# EAGLE design aiotsixsense (EAGLE 7.7.0)
CNAME: AIoT SixSense; CREVISION: R1; DESIGNER: lamloei.com/aiot_sixsense
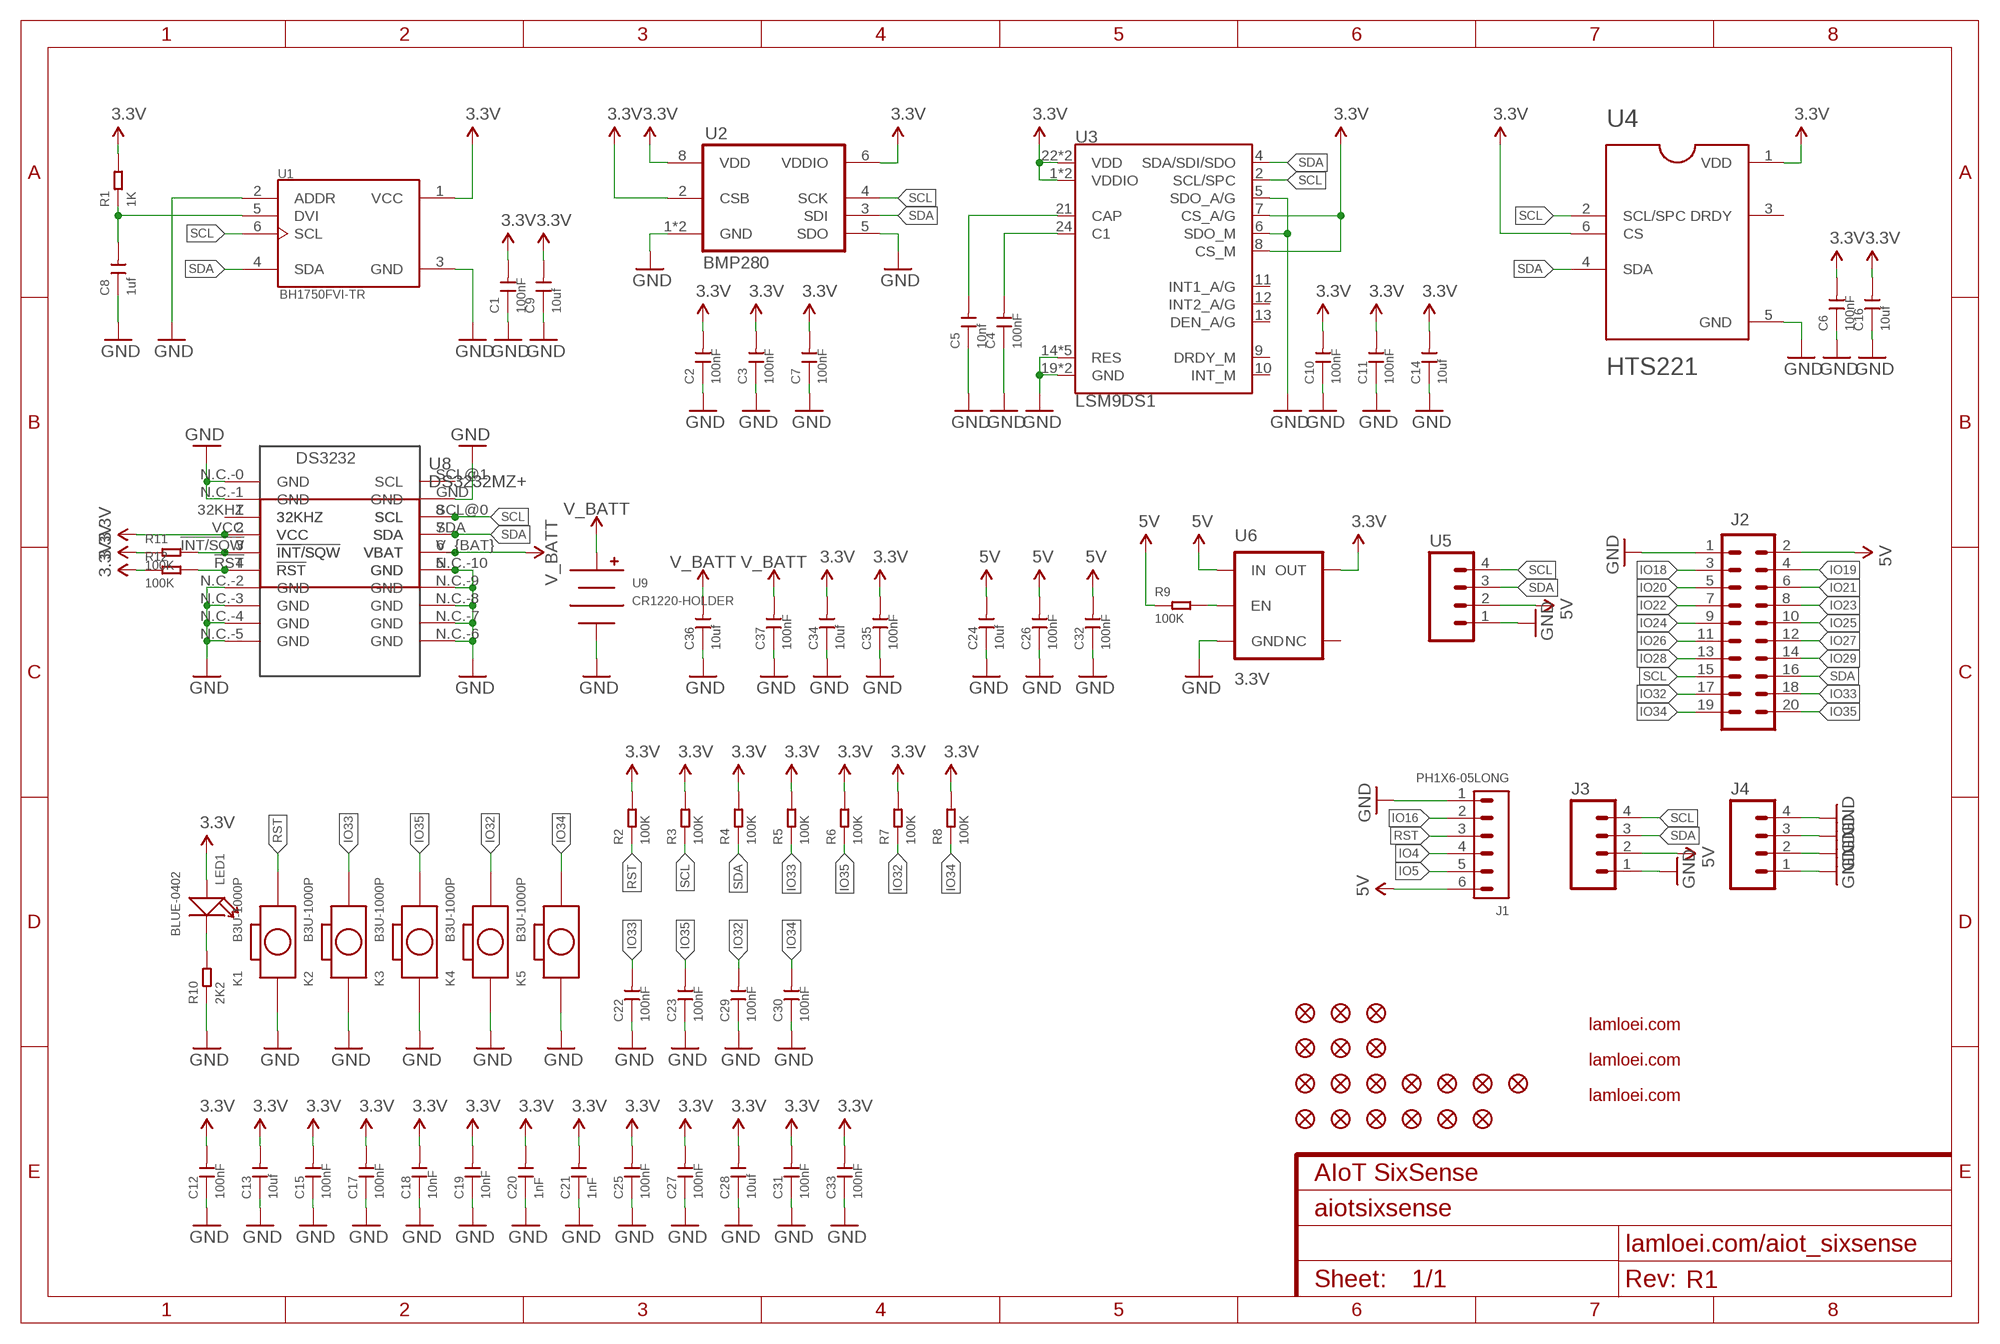
[diagram p0: schematic, sheet 1]

## Parts
C1  100nF  CERAMIC-47PF-50V-5%-NP0(0402)  [C0402]
C2  100nF  CERAMIC-47PF-50V-5%-NP0(0402)  [C0402]
C3  100nF  CERAMIC-47PF-50V-5%-NP0(0402)  [C0402]
C4  100nF  CERAMIC-47PF-50V-5%-NP0(0402)  [C0402]
C5  10nf  CERAMIC-10NF-50V-10%-X7R(0402)  [C0402]
C6  100nF  CERAMIC-47PF-50V-5%-NP0(0402)  [C0402]
C7  100nF  CERAMIC-47PF-50V-5%-NP0(0402)  [C0402]
C8  1uf  CERAMIC-1UF-10V-10%-X5R(0402)  [C0402]
C9  10uf  CERAMIC-22UF-6.3V-20%-X5R(0805)  [C0805]
C10  100nF  CERAMIC-47PF-50V-5%-NP0(0402)  [C0402]
C11  100nF  CERAMIC-47PF-50V-5%-NP0(0402)  [C0402]
C12  100nF  CERAMIC-47PF-50V-5%-NP0(0402)  [C0402]
C13  10uf  CERAMIC-22UF-6.3V-20%-X5R(0805)  [C0805]
C14  10uf  CERAMIC-22UF-6.3V-20%-X5R(0805)  [C0805]
C15  100nF  CERAMIC-47PF-50V-5%-NP0(0402)  [C0402]
C16  10uf  CERAMIC-22UF-6.3V-20%-X5R(0805)  [C0805]
C17  100nF  CERAMIC-47PF-50V-5%-NP0(0402)  [C0402]
C18  10nF  CERAMIC-47PF-50V-5%-NP0(0402)  [C0402]
C19  10nF  CERAMIC-47PF-50V-5%-NP0(0402)  [C0402]
C20  1nF  CERAMIC-47PF-50V-5%-NP0(0402)  [C0402]
C21  1nF  CERAMIC-47PF-50V-5%-NP0(0402)  [C0402]
C22  100nF  CERAMIC-47PF-50V-5%-NP0(0402)  [C0402]
C23  100nF  CERAMIC-47PF-50V-5%-NP0(0402)  [C0402]
C24  10uf  CERAMIC-22UF-6.3V-20%-X5R(0805)  [C0805]
C25  100nF  CERAMIC-47PF-50V-5%-NP0(0402)  [C0402]
C26  100nF  CERAMIC-47PF-50V-5%-NP0(0402)  [C0402]
C27  100nF  CERAMIC-47PF-50V-5%-NP0(0402)  [C0402]
C28  10uf  CERAMIC-22UF-6.3V-20%-X5R(0805)  [C0805]
C29  100nF  CERAMIC-47PF-50V-5%-NP0(0402)  [C0402]
C30  100nF  CERAMIC-47PF-50V-5%-NP0(0402)  [C0402]
C31  100nF  CERAMIC-47PF-50V-5%-NP0(0402)  [C0402]
C32  100nF  CERAMIC-47PF-50V-5%-NP0(0402)  [C0402]
C33  100nF  CERAMIC-47PF-50V-5%-NP0(0402)  [C0402]
C34  10uf  CERAMIC-22UF-6.3V-20%-X5R(0805)  [C0805]
C35  100nF  CERAMIC-47PF-50V-5%-NP0(0402)  [C0402]
C36  10uf  CERAMIC-22UF-6.3V-20%-X5R(0805)  [C0805]
C37  100nF  CERAMIC-47PF-50V-5%-NP0(0402)  [C0402]
J1  PH1X6-05LONG  [PHL005-1-6]
J2  M10X2  [2X10]
J3  M04SMD_RA_FEMALE  [1X04_SMD_RA_FEMALE]
J4  M04SMD_RA_FEMALE  [1X04_SMD_RA_FEMALE]
K1  B3U-1000P  SMD-BUTTON-WITHOUT-BOSS-(2P-3X2.5MM)  [SW2-SMD-3.0X2.5X1.2+0.4MM]
K2  B3U-1000P  SMD-BUTTON-WITHOUT-BOSS-(2P-3X2.5MM)  [SW2-SMD-3.0X2.5X1.2+0.4MM]
K3  B3U-1000P  SMD-BUTTON-WITHOUT-BOSS-(2P-3X2.5MM)  [SW2-SMD-3.0X2.5X1.2+0.4MM]
K4  B3U-1000P  SMD-BUTTON-WITHOUT-BOSS-(2P-3X2.5MM)  [SW2-SMD-3.0X2.5X1.2+0.4MM]
K5  B3U-1000P  SMD-BUTTON-WITHOUT-BOSS-(2P-3X2.5MM)  [SW2-SMD-3.0X2.5X1.2+0.4MM]
LED1  BLUE-0402  SMD-LED-CLEAR-BLUE(0402)  [LED-0402]
R1  1K  SMD-RES-1K-5%-1/16W(0402)  [R0402]
R2  100K  SMD-RES-22R-1%-1/16W(0402)  [R0402]
R3  100K  SMD-RES-100K-1%-1/16W(0402)  [R0402]
R4  100K  SMD-RES-100K-1%-1/16W(0402)  [R0402]
R5  100K  SMD-RES-100K-1%-1/16W(0402)  [R0402]
R6  100K  SMD-RES-100K-1%-1/16W(0402)  [R0402]
R7  100K  SMD-RES-100K-1%-1/16W(0402)  [R0402]
R8  100K  SMD-RES-100K-1%-1/16W(0402)  [R0402]
R9  100K  SMD-RES-100K-1%-1/16W(0402)  [R0402]
R10  2K2  SMD-RES-22R-1%-1/16W(0402)  [R0402]
R11  100K  SMD-RES-100K-1%-1/16W(0402)  [R0402]
R12  100K  SMD-RES-100K-1%-1/16W(0402)  [R0402]
U1  BH1750FVI-TR  [SOTFL50P300X75-6N]
U2  BMP280  [BMP280]
U3  LSM9DS1  [LGA-24-3.5X3]
U4  HTS221  [LGA6R75P3X2_200X200X90]
U5  M04LONGPADS  [1X04_LONGPADS]
U6  3.3V  V_REG_AP2112K-3.3V  [SOT23-5]
U7  DS3232  [SO20-2]
U8  DS3232MZ+  [SOIC127P600X175-8N]
U9  CR1220-HOLDER  [HARWIN-CR1220]
ZFCB1  FIDUCIAL1X2  [FIDUCIAL-1X2]
ZFCB2  FIDUCIAL1X2  [FIDUCIAL-1X2]
ZFCB3  FIDUCIAL1X2  [FIDUCIAL-1X2]
ZFCT1  FIDUCIAL1X2  [FIDUCIAL-1X2]
ZFCT2  FIDUCIAL1X2  [FIDUCIAL-1X2]
ZFCT3  FIDUCIAL1X2  [FIDUCIAL-1X2]
ZFDB1  FIDUCIAL1X2  [FIDUCIAL-1X2]
ZFDB2  FIDUCIAL1X2  [FIDUCIAL-1X2]
ZFDB3  FIDUCIAL1X2  [FIDUCIAL-1X2]
ZFDB4  FIDUCIAL1X2  [FIDUCIAL-1X2]
ZFDB5  FIDUCIAL1X2  [FIDUCIAL-1X2]
ZFDB6  FIDUCIAL1X2  [FIDUCIAL-1X2]
ZFDT1  FIDUCIAL1X2  [FIDUCIAL-1X2]
ZFDT2  FIDUCIAL1X2  [FIDUCIAL-1X2]
ZFDT3  FIDUCIAL1X2  [FIDUCIAL-1X2]
ZFDT4  FIDUCIAL1X2  [FIDUCIAL-1X2]
ZFDT5  FIDUCIAL1X2  [FIDUCIAL-1X2]
ZFDT6  FIDUCIAL1X2  [FIDUCIAL-1X2]
ZFDT7  FIDUCIAL1X2  [FIDUCIAL-1X2]
ZL1  LAMLOEI_BIGLOGO  [LAMLOEI_BIGLOGO]
ZL2  LAMLEOI_LOGO_3  [LAMLEOI_LOGO_3]
ZL3  LAMLEOI_LOGO_3  [LAMLEOI_LOGO_3]

## Nets
3.3V: C1.2 C2.2 C3.2 C6.2 C7.2 C9.2 C10.2 C11.2 C12.2 C13.2 C14.2 C15.2 C16.2 C17.2 C18.2 C19.2 C20.2 C21.2 C25.2 C27.2 C28.2 C31.2 C33.2 C34.2 C35.2 LED1.+ R1.2 R2.2 R3.2 R4.2 R5.2 R6.2 R7.2 R8.2 R11.1 R12.1 U1.1(VCC) U2.2(CSB) U2.6(VDDIO) U2.8(VDD) U3.1(VDDIO) U3.3(VDDIO) U3.7(CS_A/G) U3.8(CS_M) U3.22(VDD) U3.23(VDD) U4.1(VDD) U4.6(CS) U6.5(OUT) U7.VCC U8.2(VCC)
5V: C24.2 C26.2 C32.2 J1.6 J2.2 J3.2 R9.1 U5.2 U6.1(IN)
GND: C1.1 C2.1 C3.1 C4.1 C5.1 C6.1 C7.1 C8.1 C9.1 C10.1 C11.1 C12.1 C13.1 C14.1 C15.1 C16.1 C17.1 C18.1 C19.1 C20.1 C21.1 C22.1 C23.1 C24.1 C25.1 C26.1 C27.1 C28.1 C29.1 C30.1 C31.1 C32.1 C33.1 C34.1 C35.1 C36.1 C37.1 J1.1 J2.1 J3.1 J4.1 J4.2 J4.3 J4.4 K1.1 K2.1 K3.1 K4.1 K5.1 R10.1 U1.2(ADDR) U1.3(GND) U2.1(GND) U2.5(SDO) U2.7(GND) U3.5(SDO_A/G) U3.6(SDO_M) U3.14(RES) U3.15(RES) U3.16(RES) U3.17(RES) U3.18(RES) U3.19(GND) U3.20(GND) U4.5(GND) U5.1 U6.2(GND) U7.GND U7.N.C.-0(GND) U7.N.C.-1(GND) U7.N.C.-2(GND) U7.N.C.-3(GND) U7.N.C.-4(GND) U7.N.C.-5(GND) U7.N.C.-6(GND) U7.N.C.-7(GND) U7.N.C.-8(GND) U7.N.C.-9(GND) U7.N.C.-10(GND) U8.5(GND) U9.NEG
IO4: J1.4
IO5: J1.5
IO16: J1.2
IO18: J2.3
IO19: J2.4
IO20: J2.5
IO21: J2.6
IO22: J2.7
IO23: J2.8
IO24: J2.9
IO25: J2.10
IO26: J2.11
IO27: J2.12
IO28: J2.13
IO29: J2.14
IO32: C29.2 J2.17 K4.2 R7.1
IO33: C22.2 J2.18 K2.2 R5.1
IO34: C30.2 J2.19 K5.2 R8.1
IO35: C23.2 J2.20 K3.2 R6.1
N$1: U7.32KHZ U8.1(32KHZ)
N$2: R9.2 U6.3(EN)
N$3: C4.2 U3.24(C1)
N$4: R11.2 U7.!INT/SQW U8.3(!INT!/SQW)
N$5: R12.2 U7.!RST(RST) U8.4(!RST)
N$6: LED1.- R10.2
N$7: C5.2 U3.21(CAP)
N$8: C8.2 R1.1 U1.5(DVI)
RST: J1.3 K1.2 R2.1
SCL: J2.15 J3.4 R3.1 U1.6(SCL) U2.4(SCK) U3.2(SCL/SPC) U4.2(SCL/SPC) U5.4 U7.SCL@0(SCL) U8.8(SCL)
SDA: J2.16 J3.3 R4.1 U1.4(SDA) U2.3(SDI) U3.4(SDA/SDI/SDO) U4.4(SDA) U5.3 U7.SDA U8.7(SDA)
V_BATT: C36.2 C37.2 U7.V_{BAT}(VBAT) U8.6(VBAT) U9.POS
Unconnected: U3.9(DRDY_M) U3.10(INT_M) U3.11(INT1_A/G) U3.12(INT2_A/G) U3.13(DEN_A/G) U4.3(DRDY) U6.4(NC) U7.SCL@1(SCL)

## Library data of the parts
C1-C4 C6 C7 C10-C12 C15 C17-C23 C25-C27 C29-C33 C35 C37 = Capacitor-2016:CERAMIC-47PF-50V-5%-NP0(0402): 302010007; MPN: CC0402JRNPO9BN470; VALUE: 47PF
C5 = Capacitor-2016:CERAMIC-10NF-50V-10%-X7R(0402): 302010006; MPN: CC0402KRX7R9BB103
C8 = Capacitor-2016:CERAMIC-1UF-10V-10%-X5R(0402): 302010040; MPN: CC0402KRX5R6BB105
C9 C13 C14 C16 C24 C28 C34 C36 = Capacitor-2016:CERAMIC-22UF-6.3V-20%-X5R(0805): 302010171; MPN: CC0805MKX5R5BB226; VALUE: 22uf
J1 = pel_hdr:PH1X6
J2 = SparkFun-Connectors:M10X2: This was SPECIALLY designed to be used with our Graphic LCD Backpack. Be sure you want to use this! It is not only staggered on each line of header holes, but IT IS ALSO offset of the center point of the top and bottom lines by 5 mil. This causes the headers to lock into place on the "standard" footprint on the LCD screen. The extra squares on the tdocu layer are there simply to reference other pins (if you were to actually populate a longer header than ten long - this is what we do with the backpacks).
J3 J4 = SparkFun-Connectors:M04: Header 4 Standard 4-pin 0.1" header. Use with straight break away headers (SKU : PRT-00116), right angle break away headers (PRT-00553), swiss pins (PRT-00743), machine pins (PRT-00117), and female headers (PRT-00115). Molex polarized connector foot print use with SKU : PRT-08231 with associated crimp pins and housings. 1MM SMD Version SKU: PRT-10208
K1-K5 = Seeed-OPL-Button4:SMD-BUTTON-WITHOUT-BOSS-(2P-3X2.5MM): 311020047
LED1 = Seeed-OPL-Diode:SMD-LED-CLEAR-BLUE(0402): 304090075; MPN: BL-HB337A-AV-TRB
R1 = Resistor-2016:SMD-RES-1K-5%-1/16W(0402): 301010006; MPN: RC0402JR-071KL
R2 R10 = Resistor-2016:SMD-RES-22R-1%-1/16W(0402): 301010052; MPN: RC0402FR-0722RL; VALUE: 22R
R3-R9 R11 R12 = Resistor-2016:SMD-RES-100K-1%-1/16W(0402): 301010456; MPN: RC0402FR-07100KL
U1 = BH1750FVI-TR:BH1750FVI-TR: Light to Digital Ambient Light Sensor Digital O/P 1lux to 65535lux 6-Pin WSOF Embossed T/R; AVAILABILITY: Good; DESCRIPTION: Light to Digital Ambient Light Sensor Digital O/P 1lux to 65535lux 6-Pin WSOF Embossed T/R; MF: Rohm; MP: BH1750FVI-TR; PACKAGE: SMD-6 Rohm; PRICE: 2.22 USD
U2 = bosch-bmp280:BMP280: The BMP280 is an absolute barometric pressure sensor especially designed for mobile applications. The sensor module is housed in an extremely compact 8-pin metal-lid LGA package with a footprint of only 2.0 × 2.5 mm2 and 0.95 mm package height. Its small dimensions and its low power consumption of 2.7 μA @1Hz allow the implementation in battery driven devices such as mobile phones, GPS modules or watches. The library has been designed by Richard Magdycz <https://www.facebook.com/groups/eaglecadsoftUK>
U3 = SparkFun-Sensors:LSM9DS1: ST Microelectronics LSM9DS1 9DOF IMU - Accelerometer, Gyroscope & Magnetometer The LSM9DS1 is a versatile, motion-sensing system-in-a-chip. It houses a 3-axis accelerometer, 3-axis gyroscope, and 3-axis magnetometer – nine degrees of freedom (9DOF) in a single IC! The LSM9DS1 is equipped with a digital interface, but even that is flexible: it supports both I2C and SPI, so you’ll be hard-pressed to find a microcontroller it doesn’t work with. Datasheet <https://cdn.sparkfun.com/assets/learn_tutorials/3/7/3/LSM9DS1_Datasheet.pdf> SparkFun Products SparkFun 9 Degrees of Freedom IMU Breakout - LSM9DS1 <https://www.sparkfun.com/products/13284> (SEN-13284) SparkFun Photon IMU Shield <https://www.sparkfun.com/products/13629> (DEV-13629); PROD_ID: IC-12536
U4 = HTS221:HTS221: Capacitive digital sensor for relative humidity and temperature
U5 = SparkFun-Connectors:M04: Header 4 Standard 4-pin 0.1" header. Use with straight break away headers (SKU : PRT-00116), right angle break away headers (PRT-00553), swiss pins (PRT-00743), machine pins (PRT-00117), and female headers (PRT-00115). Molex polarized connector foot print use with SKU : PRT-08231 with associated crimp pins and housings. 1MM SMD Version SKU: PRT-10208; PROD_ID: CONN-09696
U6 = SparkFun-PowerIC-2:V_REG_AP2112: AP2112 - 600mA CMOS LDO Regulator w/ Enable The AP2112 is CMOS process low dropout linear regulator with enable function, the regulator delivers a guaranteed 600mA (min.) continuous load current. Features Output Voltage Accuracy: ±1.5% Output Current: 600mA (Min.) Foldback Short Current Protection: 50mA Enable Function to Turn ON/OFF VOUT Low Dropout Voltage (3.3V): 250mV (Typ.) @IOUT=600mA Excellent Load Regulation: 0.2%/A (Typ.) Excellent Line Regulation: 0.02%/V (Typ.) Low Quiescent Current: 55μA (Typ.) Low Standby Current: 0.01μA (Typ.) Low Output Noise: 50μVRMS PSRR: 100Hz -65dB, 1kHz -65dB OTSD Protection Stable with 1.0μF Flexible Cap: Ceramic, Tantalum and Aluminum Electrolytic Operation Temperature Range: -40°C to 85°C ESD: MM 400V, HBM 4000V; PROD_ID: VREG-12457
U7 = ds3232:DS3232: Maxims DS3232 is a high precision rtc
U8 = DS3232MZ+:DS3232MZ+: Real Time Clock with SRAM I2C SOIC8 Maxim DS3232MZ+ Real Time Clock Calendar, 236B RAM 8-Pin SOIC Source: Datasheet <http://uk.rs-online.com/web/p/products/9237642>; DESCRIPTION: Real Time Clock with SRAM I2C SOIC8 Maxim DS3232MZ+ Real Time Clock Calendar, 236B RAM 8-Pin SOIC; HEIGHT: 1.75mm; MANUFACTURER_NAME: Maxim Integrated; MANUFACTURER_PART_NUMBER: DS3232MZ+; RS_PART_NUMBER: 9237642
U9 = battery-holder:CR1220-HOLDER
ZFCB1-ZFCB3 ZFCT1-ZFCT3 ZFDB1-ZFDB6 ZFDT1-ZFDT7 = SparkFun-Aesthetics:FIDUCIAL: Fiducial Alignment Points Point-of-reference for pick-and-place machines and other optical instruments.
ZL1 = lamloei_logo_3:LAMLOEI_BIGLOGO
ZL2 ZL3 = lamloei_logo_3:LAMLEOI_LOGO_3: lamloei

## Board
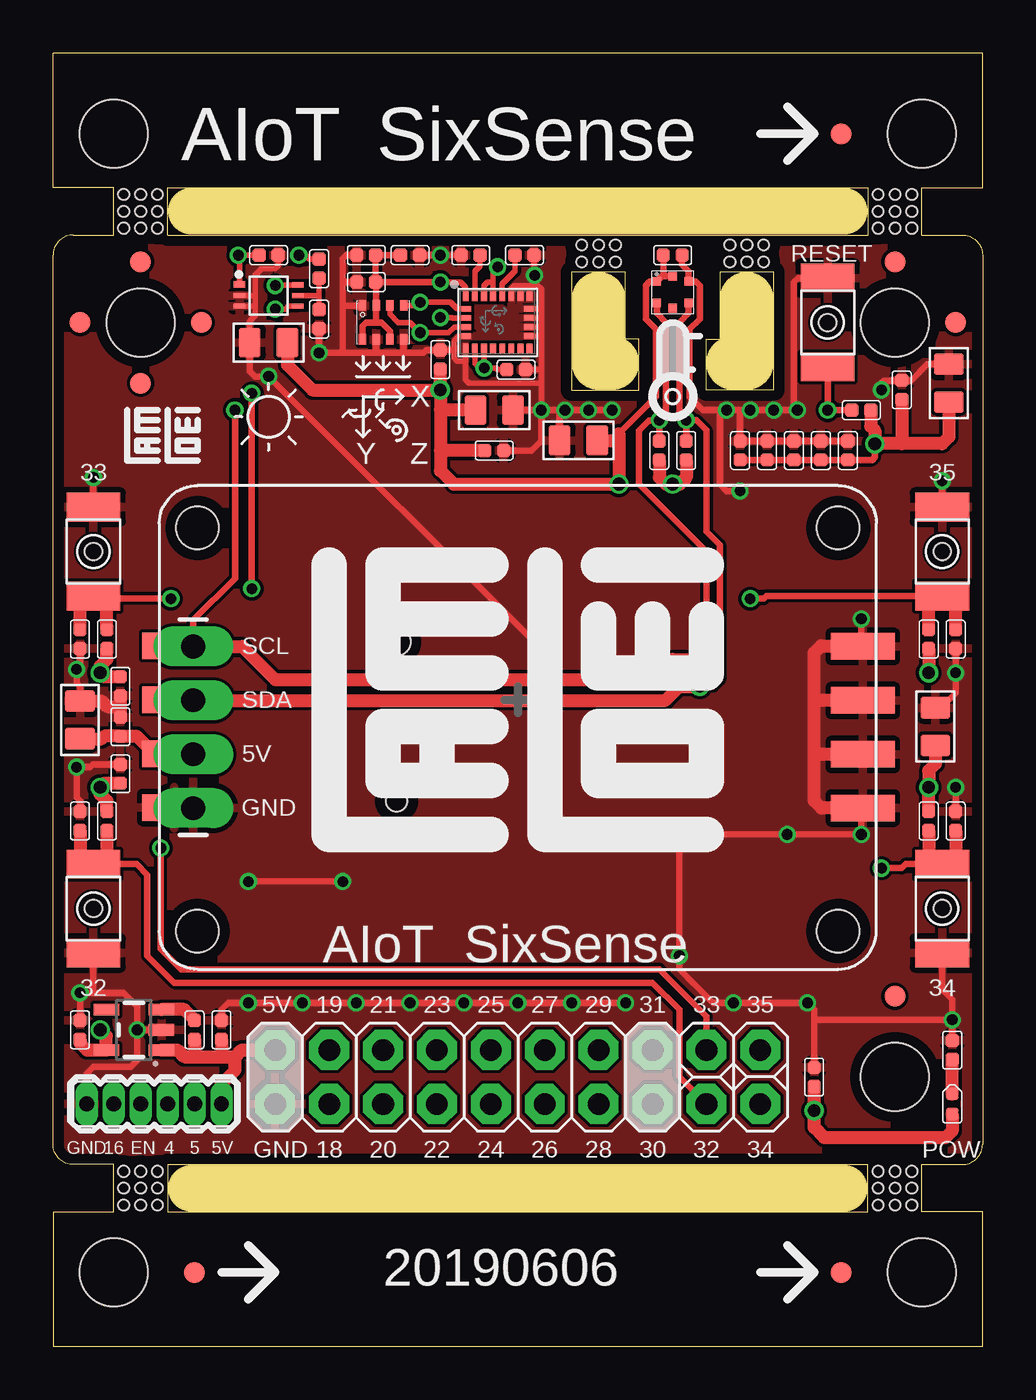
[diagram p1: board, top side]
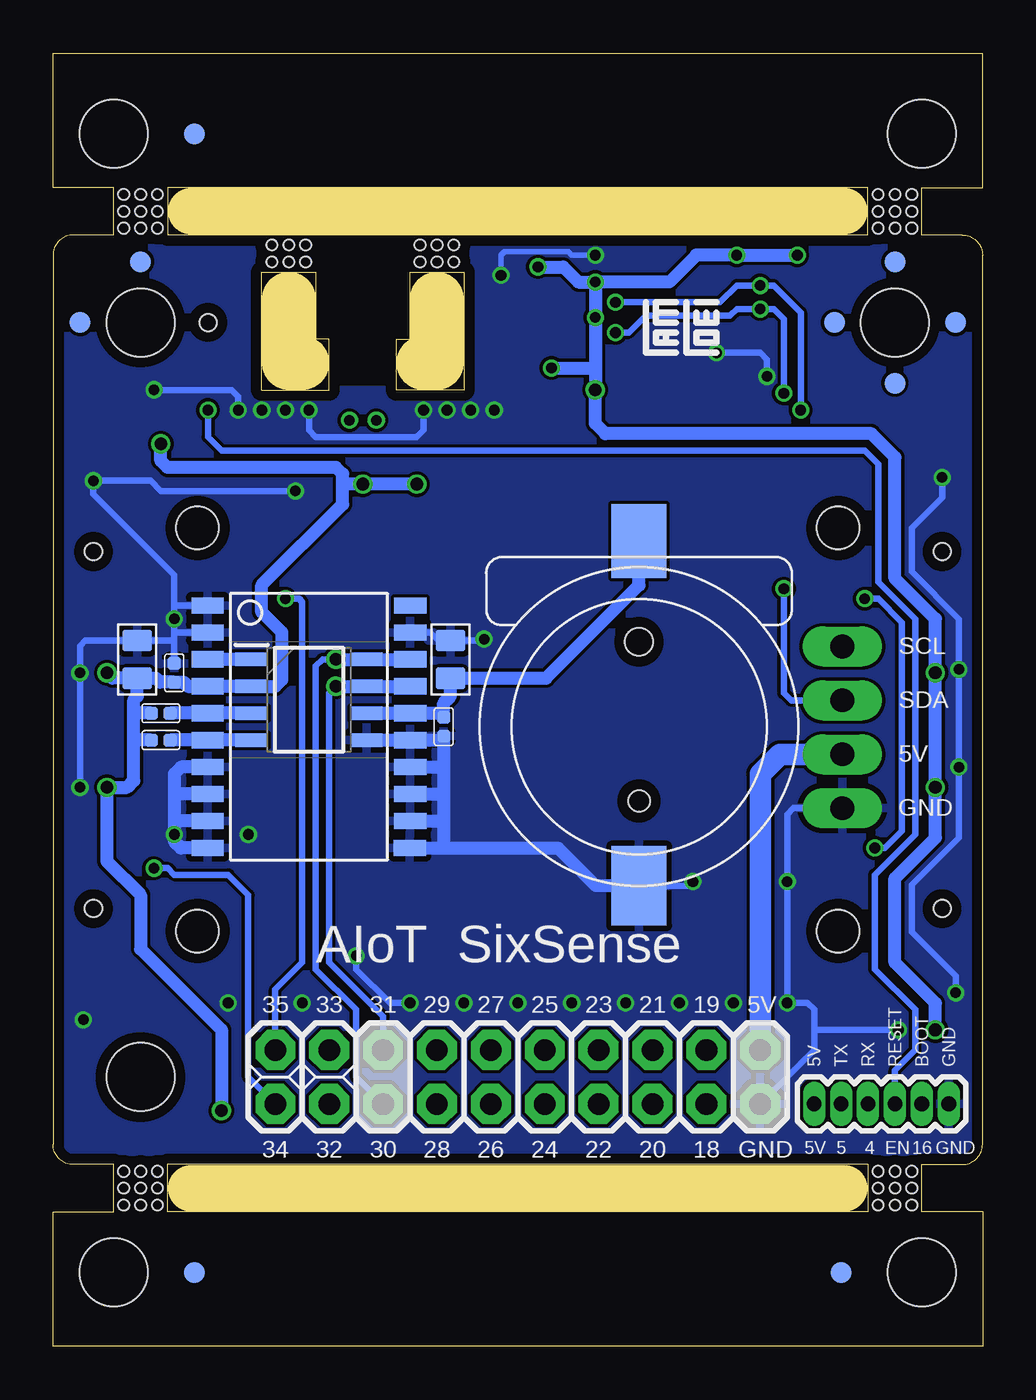
[diagram p2: board, bottom side, seen from below]

Size 43.81 x 60.96 mm. Coordinates in mm from the lower left corner, seen from the top.
Outline: 0.95,52.39 2.86,52.39 2.86,54.61 0,54.61 0,60.96 43.81,60.96 43.81,54.61 40.96,54.61 40.96,52.39 42.86,52.39 arc-90 43.81,51.43 43.81,9.53 arc-90 42.86,8.57 40.96,8.57 40.96,6.35 43.81,6.35 43.81,0 0,0 0,6.35 2.86,6.35 2.86,8.57 0.95,8.57 arc-90 0,9.53 0,51.43 arc-90 0.95,52.39
Outline: 5.4,52.39 38.42,52.39 38.42,54.61 5.4,54.61 5.4,52.39
Outline: 5.4,8.57 38.42,8.57 38.42,6.35 5.4,6.35 5.4,8.57
Outline: 33.97,50.64 31.43,50.64 31.43,47.47 30.8,47.47 30.8,45.09 33.97,45.09 33.97,50.64
Outline: 26.99,50.64 24.45,50.64 24.45,45.09 27.62,45.09 27.62,47.47 26.99,47.47 26.99,50.64
Copper layers (1*16): Top 0.035mm / dielectric 1.6mm / Bottom 0.035mm
Design rules "Elecrow_2-layer_PCB_eagle_rule-40": minimum track width 6mil, minimum drill 12mil, track to track 6mil, track to pad 6mil, pad to pad 6mil, via to via 8mil, smd to smd 0mil, copper to edge 20mil, drill to drill 10mil, minimum pad ring 6mil, minimum via ring 6mil, stop-mask expansion 0mil, vias tented up to drill 40mil, thermal gap 10mil
Holes 3.2 mm at 4.13,48.26 39.69,48.26 39.69,12.7 2.86,57.15 40.96,57.15 2.86,3.49 40.96,3.49
Holes 0.5 mm at 4.13,52.7 39.69,52.7 40.48,52.7 38.89,52.7 39.69,53.5 40.48,53.5 40.48,54.29 39.69,54.29 38.89,53.5 38.89,54.29 3.33,52.7 4.13,53.5 4.92,53.5 4.92,52.7 4.92,54.29 4.13,54.29 3.33,54.29 3.33,53.5 4.13,8.25 4.92,8.25 4.92,7.46 4.13,7.46 3.33,7.46 3.33,8.25 3.33,6.67 4.13,6.67 4.92,6.67 39.69,8.25 40.48,8.25 38.89,8.25 38.89,7.46 39.69,7.46 40.48,7.46 39.69,6.67 38.89,6.67 40.48,6.67 33.5,51.91 32.7,51.91 31.91,51.91 32.7,51.12 33.5,51.12 31.91,51.12 26.51,51.12 25.72,51.12 24.92,51.12 26.51,51.91 25.72,51.91 24.92,51.91
Holes 0.8 mm at 36.51,48.26 1.91,20.64 1.91,37.46 41.91,37.46 41.91,20.64
Holes 2 mm at 6.81,38.58 37.01,38.58 37.01,19.58 6.81,19.58
Milling: 6 lines

### Footprints (pad centres in the part's own frame; a part is rotated, then mirrored left to right if it is on the bottom)
C0402 = smd 0.635 x 0.635: 1 0,0.445; 2 0,-0.445
C0805 = smd 1.397 x 1.016: 1 0,0.889; 2 0,-0.889
PHL005-1-6 = drill 0.7 pad 1.016 long: 1 0,0; 2 1.27,0; 3 2.54,0; 4 3.81,0; 5 5.08,0; 6 6.35,0
2X10 = drill 1.016 pad 1.88 octagon: 1 -11.43,-1.27; 2 -11.43,1.27; 3 -8.89,-1.27; 4 -8.89,1.27; 5 -6.35,-1.27; 6 -6.35,1.27; 7 -3.81,-1.27; 8 -3.81,1.27; 9 -1.27,-1.27; 10 -1.27,1.27; 11 1.27,-1.27; 12 1.27,1.27; 13 3.81,-1.27; 14 3.81,1.27; 15 6.35,-1.27; 16 6.35,1.27; 17 8.89,-1.27; 18 8.89,1.27; 19 11.43,-1.27; 20 11.43,1.27
1X04_SMD_RA_FEMALE = smd 1.25 x 3: 1 -3.81,7.225; 2 -1.27,7.225; 3 1.27,7.225; 4 3.81,7.225
SW2-SMD-3.0X2.5X1.2+0.4MM = smd 1.346 x 2.54: 1 -2.095,0; 2 2.095,0
LED-0402 = smd 0.58 x 0.58: + -0.468,0; - 0.468,0
R0402 = smd 0.635 x 0.635: 1 0,0.445; 2 0,-0.445
SOTFL50P300X75-6N = smd 0.55 x 0.3: 1 -1.375,0.525 | smd 0.55 x 0.25: 2 -1.375,0; 3 -1.375,-0.5; 4 1.375,-0.5; 5 1.375,0; 6 1.375,0.5
BMP280 = smd 0.35 x 0.5: 1 0.975,-0.8; 2 0.325,-0.8; 3 -0.325,-0.8; 4 -0.975,-0.8; 5 -0.975,0.8; 6 -0.325,0.8; 7 0.325,0.8; 8 0.975,0.8
LGA-24-3.5X3 = smd 0.27 x 0.45: 1 -1.505,1.225; 6 -1.505,-1.225; 7 -1.075,-1.225; 8 -0.645,-1.225; 9 -0.215,-1.225; 10 0.215,-1.225; 11 0.645,-1.225; 12 1.075,-1.225; 13 1.505,-1.225; 18 1.505,1.225; 19 1.075,1.225; 20 0.645,1.225; 21 0.215,1.225; 22 -0.215,1.225; 23 -0.645,1.225; 24 -1.075,1.225 | smd 0.45 x 0.27: 2 -1.475,0.645; 3 -1.475,0.215; 4 -1.475,-0.215; 5 -1.475,-0.645; 14 1.475,-0.645; 15 1.475,-0.215; 16 1.475,0.215; 17 1.475,0.645
LGA6R75P3X2_200X200X90 = smd 0.406 x 0.406: 1 0.5,0.75; 2 -0.5,0.75; 3 -0.75,0; 4 -0.5,-0.75; 5 0.5,-0.75; 6 0.75,0
1X04_LONGPADS = drill 1.118 pad 1.88 long: 1 0,0; 2 2.54,0; 3 5.08,0; 4 7.62,0
SOT23-5 = smd 0.55 x 1.2: 1 -0.95,-1.3; 2 0,-1.3; 3 0.95,-1.3; 4 0.95,1.3; 5 -0.95,1.3
SO20-2 = smd 0.762 x 1.524: 32KHZ -3.175,-4.775; !INT/SQW -0.635,-4.775; !RST 0.635,-4.775; GND 0.635,4.775; N.C.-0 -5.715,-4.775; N.C.-1 -4.445,-4.775; N.C.-2 1.905,-4.775; N.C.-3 3.175,-4.775; N.C.-4 4.445,-4.775; N.C.-5 5.715,-4.775; N.C.-6 5.715,4.75; N.C.-7 4.445,4.775; N.C.-8 3.175,4.775; N.C.-9 1.905,4.775; N.C.-10 -4.445,4.775; SCL@0 -3.175,4.775; SCL@1 -5.715,4.775; SDA -1.905,4.775; V_{BAT} -0.635,4.775; VCC -1.905,-4.775
SOIC127P600X175-8N = smd 1.525 x 0.65: 1 -2.712,1.905; 2 -2.712,0.635; 3 -2.712,-0.635; 4 -2.712,-1.905; 5 2.712,-1.905; 6 2.712,-0.635; 7 2.712,0.635; 8 2.712,1.905
HARWIN-CR1220 = smd 2.6 x 3.75: NEG 0,7.5 | smd 2.6 x 3.5: POS 0,-8.75 | hole 1: 0,3.5 | hole 1.3: 0,-4
FIDUCIAL-1X2 = smd 1 x 1: 1 0,0

### Placement (x,y rotation side)
C1  10.16,51.43 270 top
C2  14.76,51.43 90 top
C3  16.83,51.43 270 top
C4  19.68,51.43 90 top
C5  22.23,51.43 270 top
C6  29.21,51.43 270 top
C7  14.76,50.16 90 top
C8  12.54,48.42 180 top
C9  10.16,47.31 90 top
C10  18.26,46.51 0 top
C11  21.83,46.04 270 top
C12  40.01,45.09 0 top
C13  42.23,45.4 0 top
C14  20.8,44.13 270 top
C15  20.8,42.23 270 top
C16  24.77,42.7 90 top
C17  32.38,42.23 0 top
C18  33.66,42.23 0 top
C19  34.92,42.23 0 top
C20  36.2,42.23 0 top
C21  37.47,42.23 0 top
C22  1.27,33.34 180 top
C23  42.55,33.34 180 top
C24  1.27,29.53 0 top
C25  3.17,31.12 180 top
C26  3.17,29.21 0 top
C27  3.17,26.99 0 top
C28  41.59,29.21 0 top
C29  1.27,24.77 0 top
C30  42.55,24.77 0 top
C31  1.27,14.92 0 top
C32  7.94,14.92 0 top
C33  35.88,12.7 0 top
C34  39.85,32.38 0 bottom
C35  38.1,31.75 0 bottom
C36  25.08,32.38 0 bottom
C37  25.4,29.21 180 bottom
J1  1.59,11.43 0 top
J2  21.91,12.7 0 top
J3  12.94,29.21 90 top
J4  30.95,29.18 270 top
K1  36.51,48.26 270 top
K2  1.91,37.46 270 top
K3  41.91,37.46 270 top
K4  1.91,20.64 90 top
K5  41.91,20.64 90 top
LED1  42.39,11.43 90 top
R1  12.54,50.8 180 top
R2  38.1,44.13 90 top
R3  28.57,42.23 0 top
R4  29.84,42.23 0 top
R5  2.54,33.34 0 top
R6  41.27,33.34 0 top
R7  2.54,24.77 180 top
R8  41.27,24.77 180 top
R9  6.67,14.92 180 top
R10  42.39,13.97 0 top
R11  38.73,29.84 90 bottom
R12  38.73,28.58 90 bottom
U1  10.16,49.53 0 top
U2  15.56,48.26 180 top
U3  20.95,48.26 0 top
U4  29.21,49.69 90 top
U5  6.61,25.37 90 top
U6  3.81,14.92 90 top
U7  31.75,29.21 270 bottom
U8  31.75,30.48 0 bottom
U9  16.19,29.21 180 bottom
ZFCB1  37.15,57.15 0 bottom
ZFCB2  6.67,3.49 0 bottom
ZFCB3  37.15,3.49 0 bottom
ZFCT1  37.15,57.15 0 top
ZFCT2  6.67,3.49 0 top
ZFCT3  37.15,3.49 0 top
ZFDB1  4.13,51.12 0 bottom
ZFDB2  39.69,51.12 0 bottom
ZFDB3  1.27,48.26 0 bottom
ZFDB4  6.99,48.26 0 bottom
ZFDB5  42.55,48.26 0 bottom
ZFDB6  4.13,45.4 0 bottom
ZFDT1  4.13,51.12 0 top
ZFDT2  39.69,51.12 0 top
ZFDT3  1.27,48.26 0 top
ZFDT4  6.99,48.26 0 top
ZFDT5  42.55,48.26 0 top
ZFDT6  4.13,45.4 0 top
ZFDT7  39.69,16.51 0 top
ZL1  13.02,24.13 0 top
ZL2  3.17,41.43 0 top
ZL3  16.19,46.51 0 bottom

### Tracks (layer width: path | path; a pad name or v marks a point on that pad's centre or on a via)
3.3V  (via drill 0.5, 0.6)
  Top 0.254: U3.22 20.74,50.17 | 20.74,50.17 20.74,50.66 v20.95,50.88 | U3.23 20.31,50 20.48,50.17 20.74,50.17 | U3.1 19.45,49.92 19.21,50.17 v18.26,50.17 | U3.7 19.88,46.32 20.08,46.12 v20.32,46.12 | U3.8 20.31,46.13 v20.32,46.12 | U3.3 18.84,48.48 18.81,48.5 v18.26,48.5 | C11.2 20.95,46.04 20.88,46.12 v20.32,46.12 | C1.2 v8.73,51.43 8.79,51.38 U1.1 | R1.2 12.1,51.24 11.91,51.43 v11.59,51.43
  Top 0.305: U4.6 28.71,50.44 U4.1 | C6.2 28.77,50.49 U4.1 | U4.1 28.12,50.19 27.94,50.01 27.94,48.42 28.42,47.94 28.42,44.77 26.67,43.02 | U2.6 15.88,47.86 15.48,48.26 15.23,48.26 | 15.23,48.26 U2.2 15.23,50.14 C7.2 | 15.23,48.26 14.76,48.26 14.58,48.08 U2.8 | v18.26,50.17 C7.2 | C7.2 C2.2 C3.2 | v38.73,42.54 38.73,41.91 38.61,41.78 C21.2 C20.2 C19.2 C18.2 C17.2
  Top 0.61: C28.2 41.59,27.46 41.27,27.15 v41.27,26.35 R8.2 | R6.2 v41.27,31.75 | LED1.+ 42.39,10.16 42.07,9.84 36.35,9.84 35.88,10.32 v35.88,11.11 C33.2 | C27.2 2.41,26.54 v2.22,26.35 2.22,26.03 2.54,25.72 R7.2 | C25.2 2.41,31.56 v2.22,31.75 2.22,32.07 2.54,32.38 R5.2 | v2.22,14.92 2.51,14.64 U6.5 1.59,13.97 1.27,14.29 C31.2 | R3.2 28.57,40.96 28.89,40.64 v29.21,40.64 29.53,40.64 29.84,40.96 R4.2 | R2.2 38.54,43.37 38.73,43.18 v38.73,42.54 40.01,42.54 | C13.2 42.23,42.86 41.91,42.54 40.01,42.54 | C12.2 40.01,42.54 | v18.26,45.09 C10.2 | 26.67,43.02 26.67,42.7 | 26.67,42.7 v26.67,40.64 18.89,40.64 18.26,41.28 18.26,42.23 | C16.2 26.67,42.7 | v18.26,45.09 18.26,44.13 | 18.26,44.13 18.26,42.23 | C14.2 18.26,44.13 | C15.2 18.26,42.23 | C9.2 11.05,46.26 12.22,45.09 v18.26,45.09
  Bottom 0.61: C34.2 38.96,31.5 38.77,31.31 C35.2 37.66,31.31 37.47,31.12 U7.VCC U8.2 33.34,31.12 33.02,31.43 33.02,33.65 33.97,34.61 33.97,35.88 30.16,39.69 30.16,40.64 | R11.1 40.01,29.85 | 40.01,28.58 40.01,26.67 40.32,26.35 v41.27,26.35 41.27,22.86 39.69,21.27 39.69,18.73 35.88,14.92 v35.88,11.11 | 40.01,28.58 40.01,29.85 | R12.1 40.01,28.58 | 41.12,31.59 v41.27,31.75 41.02,31.5 C34.2 | 40.01,29.85 40.01,30.48 39.85,30.64 C34.2 | v2.22,14.92 2.22,16.19 4.13,18.1 4.13,22.07 2.22,23.97 v2.22,26.35 v2.22,31.75 2.22,34.29 4.13,36.19 4.13,41.91 5.24,43.02 17.78,43.02 18.26,43.5 v18.26,45.09 C10.2 | 30.16,40.64 30.16,41.12 30.48,41.43 38.42,41.43 38.73,41.75 v38.73,42.54 | 30.16,40.64 v29.21,40.64 v26.67,40.64 | C10.2 v18.26,48.5 v18.26,50.17 | v20.95,50.88 19.76,50.88 19.05,50.17 v18.26,50.17 | v20.32,46.12 18.3,46.12 C10.2 | v18.26,50.17 14.76,50.17 13.49,51.43 v11.59,51.43 v8.73,51.43
5V
  Top 0.61: U5.2 6.58,27.94 J3.2 4.76,27.94 3.94,28.77 C26.2 2.41,28.77 2.29,28.64 C24.2 | U6.1 5.87,13.97 6.19,13.65 6.67,13.65 | 6.67,13.65 7.94,13.65 | 7.94,13.65 8.57,13.65 | 8.57,13.65 8.89,13.97 J2.2 | C32.2 7.94,13.65 | R9.1 6.67,13.65 | J1.6 7.94,12.38 8.57,13.02 8.57,13.65
  Bottom 1.016: U5.2 9.55,27.91 10.48,26.99 J2.2
GND  (via drill 0.5)
  Top 0.254: U3.20 21.6,49.86 21.75,50.01 22.03,50.01 | 22.7,50.01 22.86,50.01 23.02,49.85 23.02,48.91 | 23.02,48.91 23.02,48.48 | 23.02,48.48 23.02,48.04 | 23.02,48.04 23.02,47.63 | 23.02,47.63 23.02,46.04 | 23.02,46.04 23.02,45.48 | 23.02,45.48 v23.02,44.13 | U3.14 23.01,47.61 23.02,47.63 | U3.15 23.02,48.04 | U3.16 23.02,48.48 | U3.17 23.02,48.91 | U3.18 22.46,50.01 | 22.46,50.01 22.03,50.01 | U3.19 22.03,50.01 | C4.1 v18.26,51.43 | U3.5 19.12,47.61 18.89,47.39 18.89,46.99 | U3.6 19.45,46.43 | 22.7,50.01 v22.7,50.48 22.67,50.51 C5.1 | 22.7,50.01 22.46,50.01 | 18.89,46.99 18.89,46.59 19.05,46.43 19.45,46.43 | 19.45,46.43 19.45,45.56 19.61,45.4 22.94,45.4 23.02,45.48 | C11.1 23.02,46.04 | C10.1 18.86,46.96 18.89,46.99 | C1.1 10.6,50.93 10.48,50.8 9.84,50.8 9.53,50.48 9.53,49.53 | U1.2 9.53,49.53 | 9.53,49.05 9.53,48.58 9.27,48.32 C9.1 | 9.53,49.05 9.53,49.53 | U1.3 9.5,49.03 9.53,49.05
  Top 0.305: C32.1 7.94,15.88 8.26,16.19 v9.21,16.19 v11.75,16.19 v14.29,16.19 v16.83,16.19 v19.37,16.19 v21.91,16.19 v24.45,16.19 v26.99,16.19 | C30.1 v42.55,26.35 | C28.1 41.85,30.1 42.55,30.8 v42.55,31.75 C23.1 | 38.1,33.02 v38.1,34.29 | J4.4 38.13,25.37 38.1,25.4 v38.1,24.13 v34.61,24.13 30.16,24.13 29.53,23.49 v29.53,18.41 29.53,17.78 31.11,16.19 v32.07,16.19 v35.56,16.19 35.88,15.88 35.88,15.4 | R10.1 v42.39,15.4 | v42.39,15.4 42.39,16.35 41.91,16.83 K5.1 | K1.1 35.12,50.36 34.92,50.17 34.92,44.29 v35.08,44.13 v33.97,44.13 v32.86,44.13 | C22.1 1.27,32.07 v1.11,31.91 1.11,31.27 1.27,31.12 C24.1 | C27.1 1.87,27.43 1.75,27.31 v1.11,27.31 1.11,25.88 1.27,25.72 C29.1 | U6.2 v3.97,14.92 | v3.97,14.92 3.97,16.03 3.33,16.67 1.91,16.67 | K4.1 1.91,16.67 | J1.1 1.59,12.86 1.91,13.18 3.65,13.18 3.97,13.49 v3.97,14.92 | C31.1 v1.27,16.67 1.91,16.67 | v1.91,40.96 K2.1 | v13.65,21.91 v9.21,21.91 | C33.1 35.88,15.4 | 35.88,15.4 v42.39,15.4 | C6.1 29.65,50.99 29.96,50.68 U4.5 30.3,50.19 30.48,50.01 30.48,48.42 30,47.94 30,44.77 30.64,44.13 31.43,44.13 | 31.43,44.13 v31.75,44.13 v32.86,44.13 | v41.91,40.8 K3.1 | v23.02,44.13 v24.13,44.13 | v24.13,44.13 v25.24,44.13 v26.35,44.13 | C13.1 41.21,46.29 40.45,45.53 C12.1 39.18,45.53 39.05,45.4 v39.05,45.09 | C14.1 v23.02,44.13 | C16.1 23.88,44.13 v24.13,44.13 | C15.1 22.54,42.23 23.02,42.7 v23.02,44.13 | 16.51,46.83 17.46,46.83 17.59,46.96 C10.1 | U2.5 16.53,46.85 16.51,46.83 | 15.23,46.83 16.51,46.83 | U2.7 15.23,46.83 | C3.1 v18.26,51.43 | 13.65,49.05 13.65,50.17 | 13.65,50.17 13.65,51.28 13.81,51.43 C2.1 | U2.1 13.98,49.06 13.65,49.05 | C7.1 13.65,50.17 | C8.1 v12.54,46.83 13.65,46.83
  Top 0.305: 15.23,46.83 13.65,46.83 | 13.65,49.05 13.65,46.83 | C9.1 9.27,45.97 9.53,45.72 v10.16,45.72 22.54,33.34 v23.5,33.34 | v32.38,40.32 31.75,40.32 31.43,40.64 31.43,44.13 | C21.1 C20.1 C19.1 C18.1 C17.1 32.38,44.13 v32.86,44.13
  Top 0.61: C25.1 3.17,30.16 | 3.17,30.16 C26.1 | J4.4 36.23,25.37 35.88,25.72 35.88,27.94 | 35.88,27.94 35.88,30.48 | 35.88,30.48 35.88,32.7 36.2,33.02 38.1,33.02 38.14,33.02 J4.1 | J4.3 35.91,27.91 35.88,27.94 | J4.2 35.91,30.45 35.88,30.48 | C24.1 2.29,30.42 2.54,30.16 3.17,30.16 | J3.1 6.58,25.4 U5.1
  Bottom 0.254: v18.26,51.43 19.37,51.43 19.53,51.59 22.54,51.59 22.7,51.43 v22.7,50.48
  Bottom 0.305: 7.94,14.92 7.94,15.88 8.26,16.19 v9.21,16.19 v9.21,21.91 9.21,25.08 8.92,25.37 U5.1 | 7.94,14.92 7.94,13.97 J2.1 | v42.55,26.35 v42.55,31.75 42.55,33.02 42.29,33.27 C34.1 38.1,33.27 | C35.1 38.1,33.27 | 38.1,33.65 v38.1,34.29 38.1,34.92 | 38.1,33.65 38.1,33.27 | U7.N.C.-1 38.1,33.65 | v38.1,24.13 38.1,25.4 | v3.97,14.92 7.94,14.92 | v1.27,16.67 1.27,17.46 3.33,19.53 3.33,21.75 1.11,23.97 v1.11,27.31 v1.11,31.91 1.11,34.29 3.33,36.51 3.33,38.58 1.91,40.01 v1.91,40.96 | U9.NEG 13.85,21.71 v13.65,21.91 | v26.99,16.19 27.94,16.19 29.53,17.78 v29.53,18.41 | 38.1,34.92 38.1,36.35 41.91,40.16 v41.91,40.8 39.21,40.8 38.73,40.32 v32.38,40.32 | U7.N.C.-0 38.1,34.92 | v26.35,44.13 26.35,43.18 26.67,42.86 31.43,42.86 31.75,43.18 v31.75,44.13 | v39.05,45.09 35.4,45.09 35.08,44.77 v35.08,44.13 | v12.54,46.83 10.48,46.83 10.16,46.51 v10.16,45.72 | v23.5,33.34 23.56,33.27 C36.1 25.65,33.27 26.04,33.65 U7.N.C.-10
  Bottom 0.61: U8.5 U7.GND 25.59,28.58 C37.1 25.4,27.31 | 25.4,27.31 25.4,26.03 | 25.4,26.03 25.4,24.76 | U7.N.C.-7 25.4,24.76 | U7.N.C.-8 25.4,26.03 | U7.N.C.-9 25.4,27.31 | U7.N.C.-2 37.78,27.31 38.1,26.99 38.1,26.03 | 38.1,26.03 38.1,25.4 38.1,24.76 | 38.1,24.76 v38.1,24.13 38.1,23.81 37.78,23.49 U7.N.C.-5 | U7.N.C.-4 38.1,24.76 | U7.N.C.-3 38.1,26.03 | U7.N.C.-6 25.4,23.49 | 25.4,23.49 20,23.49 18.22,21.71 U9.NEG | 25.4,24.76 25.4,23.49
  pour Bottom: 0,8.57 43.81,8.57 43.81,52.39 33.97,52.39 33.97,45.09 24.45,45.09 24.45,52.39 0,52.39
  pour Top: 0,52.39 24.45,52.39 24.45,45.09 33.97,45.09 33.97,52.39 43.81,52.39 43.81,8.57 0,8.57
IO32
  Top 0.305: J2.17 29.53,12.7 29.53,15.88 28.26,17.14 5.71,17.14 4.45,18.41 4.45,22.22 3.94,22.73 K4.2
  Top 0.61: C29.2 1.27,22.73 K4.2 2.54,22.73 R7.1
IO33  (via drill 0.5)
  Top 0.305: J2.18 30.8,15.56 28.57,17.78 6.03,17.78 5.08,18.73 v5.08,23.49 | v5.56,35.24 2.03,35.24 K2.2
  Top 0.61: C22.2 1.27,35.37 K2.2 2.54,35.37 R5.1
  Bottom 0.305: v5.56,35.24 4.92,35.24 3.81,34.13 3.81,24.29 4.6,23.49 v5.08,23.49
IO34  (via drill 0.5)
  Top 0.305: K5.2 40.2,22.73 40.01,22.54 v39.05,22.54
  Top 0.61: R8.1 41.27,22.73 K5.2 42.55,22.73 C30.2
  Bottom 0.305: J2.19 34.61,12.7 34.61,21.27 35.56,22.22 38.1,22.22 38.42,22.54 v39.05,22.54
IO35  (via drill 0.5)
  Top 0.305: v32.86,35.24 33.5,35.24 33.62,35.37 41.27,35.37 K3.2
  Top 0.61: C23.2 42.55,35.37 K3.2 | R6.1 41.27,35.37
  Bottom 0.305: J2.20 33.34,16.83 32.07,18.1 32.07,35.08 32.23,35.24 v32.86,35.24
N$1
  Bottom 0.61: U8.1 U7.32KHZ
N$2
  Top 0.61: R9.2 6.67,15.4 6.19,15.88 U6.3
N$3
  Top 0.254: U3.24 19.88,50.68 20.13,50.93 C4.2
N$4
  Bottom 0.61: U8.3 U7.!INT/SQW R11.2
N$5
  Bottom 0.61: U8.4 U7.!RST R12.2
N$6
  Top 0.61: LED1.- R10.2
N$7
  Top 0.254: U3.21 21.17,50.06 21.78,50.67 C5.2
N$8
  Top 0.254: U1.5 12.54,49.53 | 12.54,49.53 C8.2 | R1.1 12.54,49.53
RST  (via drill 0.5)
  Top 0.305: K1.2 v36.51,44.13 R2.1
  Bottom 0.305: J1.3 4.13,13.02 3.17,13.97 3.17,15.88 5.08,17.78 5.08,22.22 3.17,24.13 3.17,34.29 4.92,36.04 4.92,41.59 5.56,42.23 35.88,42.23 36.51,42.86 v36.51,44.13
SCL  (via drill 0.5, 0.6)
  Top 0.254: U3.2 19.04,48.91 18.73,49.21 v17.3,49.21 17.15,49.06 U2.4 | U1.6 10.5,50.03 v10.48,50.01
  Top 0.305: U4.2 28.46,48.69 28.89,48.26 28.89,43.97 v28.57,43.66 | v30.48,32.38 30.8,32.7 30.8,37.46 27.62,40.64 27.62,43.16 28.09,43.63 28.55,43.63 v28.57,43.66 | R3.1 v28.57,43.66 | v8.57,44.13 8.57,36.19 6.61,34.23 U5.4
  Top 0.61: U5.4 7.3,32.99 | 7.3,32.99 8.92,32.99 10.48,31.43 28.26,31.43 29.21,32.38 v30.48,32.38 | J3.4 7.27,33.02 7.3,32.99
  Bottom 0.305: J2.15 29.53,12.7 29.53,15.88 31.43,17.78 31.43,32.07 31.11,32.38 v30.48,32.38 | v8.57,44.13 8.57,48.74 9.84,50.01 v10.48,50.01 11.59,50.01 12.38,49.21 v17.3,49.21
  Bottom 0.61: U7.SCL@0 U8.8 v30.48,32.38
SDA  (via drill 0.5, 0.6)
  Top 0.254: U3.4 18.91,48.04 18.65,47.78 v17.3,47.78 16.83,48.26 16.27,48.26 15.88,48.65 U2.3 | U1.4 11.09,49.03 10.95,48.89 v10.48,48.89
  Top 0.305: U4.4 29.96,48.69 29.53,48.26 29.53,43.97 v29.84,43.66 | v30.48,31.12 31.11,31.12 31.43,31.43 31.43,37.78 30.8,38.42 30.8,43.18 30.32,43.66 v29.84,43.66 | R4.1 v29.84,43.66 | v9.37,44.93 v9.37,35.72
  Top 0.61: v30.48,31.12 29.53,31.12 28.86,30.45 U5.3 6.58,30.48 J3.3
  Bottom 0.305: J2.16 28.26,15.56 30.8,18.1 30.8,30.8 v30.48,31.12 | v9.37,44.93 9.37,48.42 9.84,48.89 v10.48,48.89 11.59,48.89 11.91,48.58 15.88,48.58 16.67,47.78 v17.3,47.78 | U5.3 9.02,30.45 9.37,30.8 v9.37,35.72
  Bottom 0.61: U7.SDA U8.7 v30.48,31.12
V_BATT
  Bottom 0.61: U8.6 U7.V_{BAT} 25.59,29.85 C37.2 25.4,30.32 25.08,30.64 C36.2 20.57,31.5 16.19,35.88 U9.POS

### Text on the board
tPlace: AIoT | SixSense | RESET | X | Y | Z | 33 | 35 | SCL | SDA | 5V | GND | AIoT | SixSense | 32 | 34 | 5V | 19 | 21 | 23 | 25 | 27 | 29 | 31 | 33 | 35 | GND | 16 | EN | 4 | 5 | 5V | GND | 18 | 20 | 22 | 24 | 26 | 28 | 30 | 32 | 34 | POW | 20190606
bPlace: SCL | SDA | 5V | GND | SixSense | AIoT | 5V | 19 | 21 | 23 | 25 | 27 | 29 | 31 | 33 | 35 | GND | BOOT | RESET | RX | TX | 5V | GND | 16 | EN | 4 | 5 | 5V | GND | 18 | 20 | 22 | 24 | 26 | 28 | 30 | 32 | 34
tDocu: C1 | 100n | R1 | C2 | 100n | C3 | 100n | C4 | 100n | C5 | 10n | C6 | 100n | 1K | BH1750 | U1 | C7 | 100n | HTS221 | U4 | C8 | U2 | U3 | K1 | C9 | 10U | 1U | BMP280 | LSM9DS1 | C10 | 100n | C11 | 100n | C12 | C13 | 100n | 10U | C14 | 10U | R2 | 100K | C16 | 10U | R3 | R4 | C17 | C18 | C19 | C20 | C21 | C15 | 100n | 100K | 100K | 100n | 10n | 10n | 1n | 1n | K2 | K3 | C22 | R5 | R6 | C23 | 100n | 100K | 100K | 100n | C25 | C24 | 100n | C26 | C28 | 10U | 100n | 10U | C27 | 100n | C29 | R7 | R8 | C30 | 100n | 100K | 100K | 100n | U5 | K4 | K5 | C31 | R9 | C32 | 100n | U6 | 3.3V | 100K | 100n | R10 | AP2112K | 2K2 | J2 | C33 | J1 | 100n | LED1 | BLU
bDocu: C36 | C34 | 10U | 100n | C35 | 10U | U8 | U9 | C37 | U7 | DS3232MZ | 100K | R11 | CR1220 | 100n | DS3232 | 100K | R12